# Altium schematic sheet FPGA_PWR.SchDoc: TE0723 - FPGA PWR
size A4; PageSetup: Record=PageOptions|CenterHorizontal=True|CenterVertical=True|PrintScale=0.96|XCorrection=1.00|YCorrection=1.00|PrintKind=0|BorderSize=5000000|LeftOffset=0|BottomOffset=0|Orientation=2|PaperLength=1000|PaperWidth=1000|Scale=100|PaperSource=7|PrintQuality=-4|MediaType=1|DitherType=10|PaperKind=A4|PrintScaleMode=1; Organization: Trenz Electronic GmbH; DocumentNumber: TE0723; Revision: 01; SheetNumber: 5; SheetTotal: 12; Date: 08.07.2015; Author: Indrek Tubalkain; CompanyName: Trenz Electronic GmbH; DrawnBy: Indrek Tubalkain; Engineer: Indrek Tubalkain; ProjectName: TE0723 Arduino
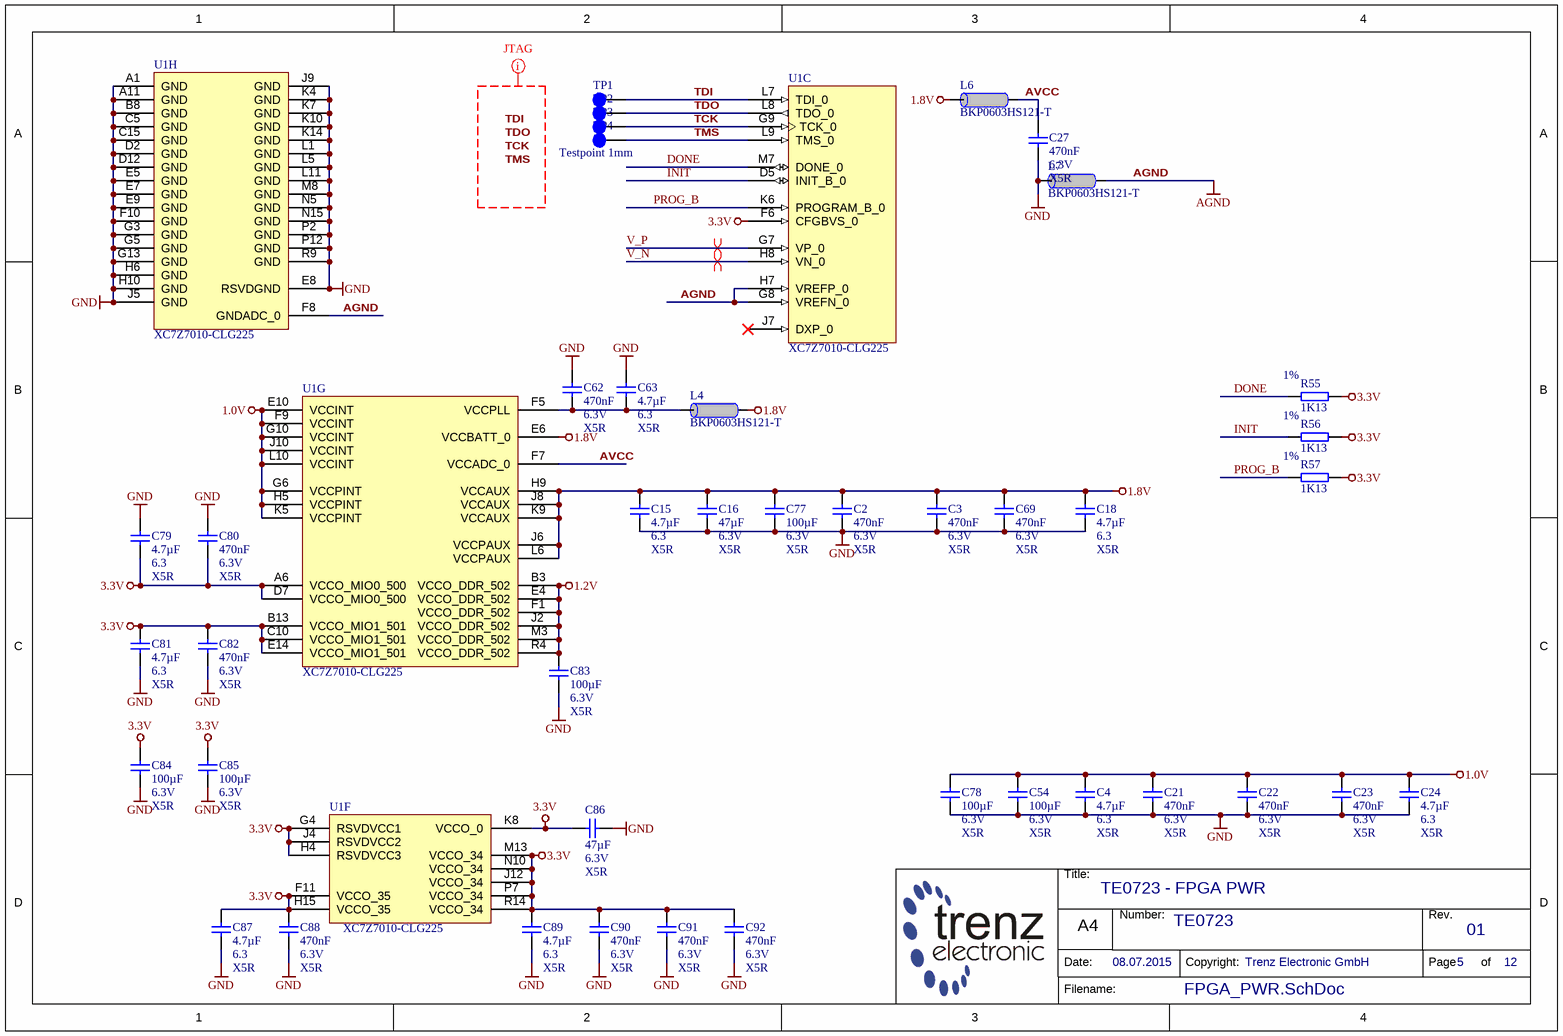
[diagram p0: FPGA_PWR.SchDoc]

## Parts
C2  470nF  Voltage: 6.3V  Technology: X5R  [CAPC0603X33N]
C3  470nF  Voltage: 6.3V  Technology: X5R  [CAPC0603X33N]
C4  4.7µF  Voltage: 6.3  Technology: X5R  [CAPC1005X60N]
C15  4.7µF  Voltage: 6.3  Technology: X5R  [CAPC1005X60N]
C16  47µF  Voltage: 6.3V  Technology: X5R  [CAPC2012X135N]
C18  4.7µF  Voltage: 6.3  Technology: X5R  [CAPC1005X60N]
C21  470nF  Voltage: 6.3V  Technology: X5R  [CAPC0603X33N]
C22  470nF  Voltage: 6.3V  Technology: X5R  [CAPC0603X33N]
C23  470nF  Voltage: 6.3V  Technology: X5R  [CAPC0603X33N]
C24  4.7µF  Voltage: 6.3  Technology: X5R  [CAPC1005X60N]
C27  470nF  Voltage: 6.3V  Technology: X5R  [CAPC0603X33N]
C54  100µF  Voltage: 6.3V  Technology: X5R  [CAPC3216X180N]
C62  470nF  Voltage: 6.3V  Technology: X5R  [CAPC0603X33N]
C63  4.7µF  Voltage: 6.3  Technology: X5R  [CAPC1005X60N]
C69  470nF  Voltage: 6.3V  Technology: X5R  [CAPC0603X33N]
C77  100µF  Voltage: 6.3V  Technology: X5R  [CAPC3216X180N]
C78  100µF  Voltage: 6.3V  Technology: X5R  [CAPC3216X180N]
C79  4.7µF  Voltage: 6.3  Technology: X5R  [CAPC1005X60N]
C80  470nF  Voltage: 6.3V  Technology: X5R  [CAPC0603X33N]
C81  4.7µF  Voltage: 6.3  Technology: X5R  [CAPC1005X60N]
C82  470nF  Voltage: 6.3V  Technology: X5R  [CAPC0603X33N]
C83  100µF  Voltage: 6.3V  Technology: X5R  [CAPC3216X180N]
C84  100µF  Voltage: 6.3V  Technology: X5R  [CAPC3216X180N]
C85  100µF  Voltage: 6.3V  Technology: X5R  [CAPC3216X180N]
C86  47µF  Voltage: 6.3V  Technology: X5R  [CAPC2012X135N]
C87  4.7µF  Voltage: 6.3  Technology: X5R  [CAPC1005X60N]
C88  470nF  Voltage: 6.3V  Technology: X5R  [CAPC0603X33N]
C89  4.7µF  Voltage: 6.3  Technology: X5R  [CAPC1005X60N]
C90  470nF  Voltage: 6.3V  Technology: X5R  [CAPC0603X33N]
C91  470nF  Voltage: 6.3V  Technology: X5R  [CAPC0603X33N]
C92  470nF  Voltage: 6.3V  Technology: X5R  [CAPC0603X33N]
L4  BKP0603HS121-T  [INDC0603X33N]
L6  BKP0603HS121-T  [INDC0603X33N]
L7  BKP0603HS121-T  [INDC0603X33N]
R55  1K13  Tolerance: 1%  [RESC1005X40N]
R56  1K13  Tolerance: 1%  [RESC1005X40N]
R57  1K13  Tolerance: 1%  [RESC1005X40N]
TP1  Testpoint 1mm  [TP_1mm]  (value not drawn)
TP2  Testpoint 1mm  [TP_1mm]  (value not drawn)
TP3  Testpoint 1mm  [TP_1mm]  (value not drawn)
TP4  Testpoint 1mm  [TP_1mm]
U1  XC7Z7010-CLG225  (parts C,F,G,H of 8)

## Nets
1.0V: C4.1 C21.2 C22.2 C23.2 C24.1 C54.1 C78.1 U1.E10(VCCINT) U1.F9(VCCINT) U1.G6(VCCPINT) U1.G10(VCCINT) U1.H5(VCCPINT) U1.J10(VCCINT) U1.K5(VCCPINT) U1.L10(VCCINT)
1.2V: C83.1 U1.B3(VCCO_DDR_502) U1.E4(VCCO_DDR_502) U1.F1(VCCO_DDR_502) U1.J2(VCCO_DDR_502) U1.M3(VCCO_DDR_502) U1.R4(VCCO_DDR_502)
1.8V: C2.2 C3.1 C15.1 C16.1 C18.1 C69.1 C77.1 L4.1 L6.2 U1.E6(VCCBATT_0) U1.H9(VCCAUX) U1.J6(VCCPAUX) U1.J8(VCCAUX) U1.K9(VCCAUX) U1.L6(VCCPAUX)
3.3V: C79.1 C80.2 C81.1 C82.2 C84.1 C85.1 C86.2 C87.1 C88.2 C89.1 C90.2 C91.2 C92.2 R55.2 R56.2 R57.2 U1.A6(VCCO_MIO0_500) U1.B13(VCCO_MIO1_501) U1.C10(VCCO_MIO1_501) U1.D7(VCCO_MIO0_500) U1.E14(VCCO_MIO1_501) U1.F6(CFGBVS_0) U1.F11(VCCO_35) U1.G4(RSVDVCC1) U1.H4(RSVDVCC3) U1.H15(VCCO_35) U1.J4(RSVDVCC2) U1.J12(VCCO_34) U1.K8(VCCO_0) U1.M13(VCCO_34) U1.N10(VCCO_34) U1.P7(VCCO_34) U1.R14(VCCO_34)
AGND: L7.1 U1.F8(GNDADC_0) U1.G8(VREFN_0) U1.H7(VREFP_0)
GND: C2.1 C3.2 C4.2 C15.2 C16.2 C18.2 C21.1 C22.1 C23.1 C24.2 C27.1 C54.2 C62.1 C63.1 C69.2 C77.2 C78.2 C79.2 C80.1 C81.2 C82.1 C83.2 C84.2 C85.2 C86.1 C87.2 C88.1 C89.2 C90.1 C91.1 C92.1 L7.2 U1.A1(GND) U1.A11(GND) U1.B8(GND) U1.C5(GND) U1.C15(GND) U1.D2(GND) U1.D12(GND) U1.E5(GND) U1.E7(GND) U1.E8(RSVDGND) U1.E9(GND) U1.F10(GND) U1.G3(GND) U1.G5(GND) U1.G13(GND) U1.H6(GND) U1.H10(GND) U1.J5(GND) U1.J9(GND) U1.K4(GND) U1.K7(GND) U1.K10(GND) U1.K14(GND) U1.L1(GND) U1.L5(GND) U1.L11(GND) U1.M8(GND) U1.N5(GND) U1.N15(GND) U1.P2(GND) U1.P12(GND) U1.R9(GND)
AVCC: C27.2 L6.1 U1.F7(VCCADC_0)
DONE: R55.1 U1.M7(DONE_0)
INIT: R56.1 U1.D5(INIT_B_0)
PROG_B: R57.1 U1.K6(PROGRAM_B_0)
TCK: TP3.1 U1.G9(TCK_0)
TDI: TP1.1 U1.L7(TDI_0)
TDO: TP2.1 U1.L8(TDO_0)
TMS: TP4.1 U1.L9(TMS_0)
V_N: U1.H8(VN_0)
V_P: U1.G7(VP_0)
NetC62_2: C62.2 C63.2 L4.2 U1.F5(VCCPLL)

Not connected (* = marked no-connect by the designer): U1 J7(DXP_0)*

## Layout directives
net class JTAG: TCK, TDI, TDO, TMS
differential pair: V_N, V_P

## Notes on the sheet
- Labels drawn without touching a wire or pin: TCK, TDI, TDO, TMS
- Title:
- Number:
- Rev.
- Date:
- A4
- Copyright:
- Page
- of
- Filename:

## Library data of the parts
C2 C3 C21-C23 C27 C69 C80 C82 C88 C90-C92 = 24921: KON 470nF X5R 6.3V SMD 20%; AN: 24921; Value: 470n; Mixed: SMT; Preferred: Yes; Case: 0603 (0201); Tolerance: 20%
C4 C15 C18 C24 C63 C79 C81 C87 C89 = 24719: KON 4.7µF 6.3V X5R SMD 20%; AN: 24719; Mixed: SMT; Value: 4.7u; Preferred: Yes; Case: 1005 (0402); Tolerance: 20%
C16 C86 = 24718: KON 47µF 6,3V  X5R SMD 20%; AN: 24718; Mixed: SMT; Value: 47u; Preferred: Yes; Case: 2012 (0805); Tolerance: 20%
C54 C77 C78 C83-C85 = 23116: KON 100µF 6,3V X5R SMD 20%; AN: 23116; Mixed: SMT; Value: 100u; Preferred: Yes; Case: 3216 (1206); Tolerance: 20%
C62 = 24921: KON 470nF X5R 6.3V SMD 20%; AN: 24921; Mixed: SMT; Value: 470n; Preferred: Yes; Case: 0603 (0201); Tolerance: 20%
L4 L6 L7 = 25393: Ferritdurchführung SMD 0201; AN: 25393; Trenz-Stock: Yes; Mixed: SMT; Tolerance: 25%; Case: 0603 (0201); HelpURL: B:\AD\adlib\datasheet\MULTILAYER CHIP BEAD INDUCTORS BK; Preferred: Yes
R55-R57 = 23160: WID SMD 1K13 1% 0,063W; AN: 23160; Mixed: SMT; Value: 1.13K; Preferred: Yes; Case: 1005 (0402)
TP1-TP4 = 25063: AN: 25063; Mixed: SMT